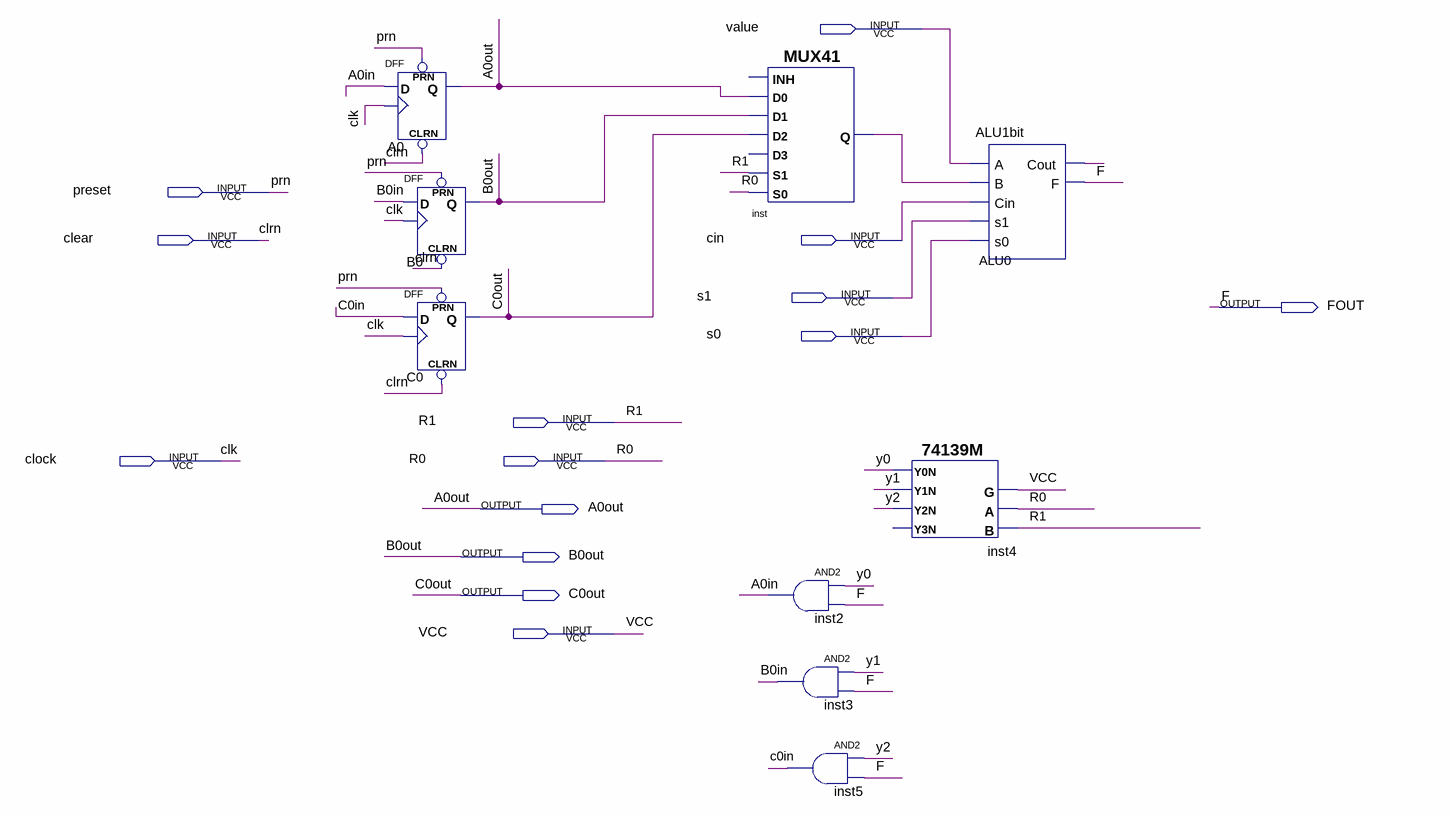
[diagram p0: schematic sheet]
// Quartus schematic EU1bitTest.bdf as structural Verilog: 9 symbols, 14 pins
module EU1bitTest (
  input  value,
  input  preset,
  input  clear,
  input  cin,
  input  s1,
  input  s0,
  input  R1,
  input  clock,
  input  R0,
  input  VCC,
  output FOUT,
  output A0out,
  output B0out,
  output C0out
);

  wire A0in, ALU0_cout, B0in, C0in, inst_q, y0, y1, y2;

  DFF A0 (.CLRN(clear), .CLK(clock), .D(A0in), .PRN(preset), .Q(A0out));
  DFF B0 (.CLRN(clear), .CLK(clock), .D(B0in), .PRN(preset), .Q(B0out));
  DFF C0 (.CLRN(clear), .CLK(clock), .D(C0in), .PRN(preset), .Q(C0out));
  MUX41 inst (.S0(R0), .D2(C0out), .S1(R1), .D0(A0out), .D1(B0out), .Q(inst_q));  // open: D3, INH
  and inst2 (A0in, y0, FOUT);
  and inst3 (B0in, y1, FOUT);
  and inst5 (C0in, y2, FOUT);
  \74139M  inst4 (.B(R1), .A(R0), .G(VCC), .Y2N(y2), .Y0N(y0), .Y1N(y1));  // open: Y3N
  ALU1bit ALU0 (.A(value), .B(inst_q), .Cin(cin), .s1(s1), .s0(s0), .Cout(ALU0_cout), .F(FOUT));

  // Other names for the same wires on the sheet: clk = clock; clrn = clear; F = FOUT; prn = preset
endmodule
